# EAGLE schematic untitled (EAGLE 9.4.0)
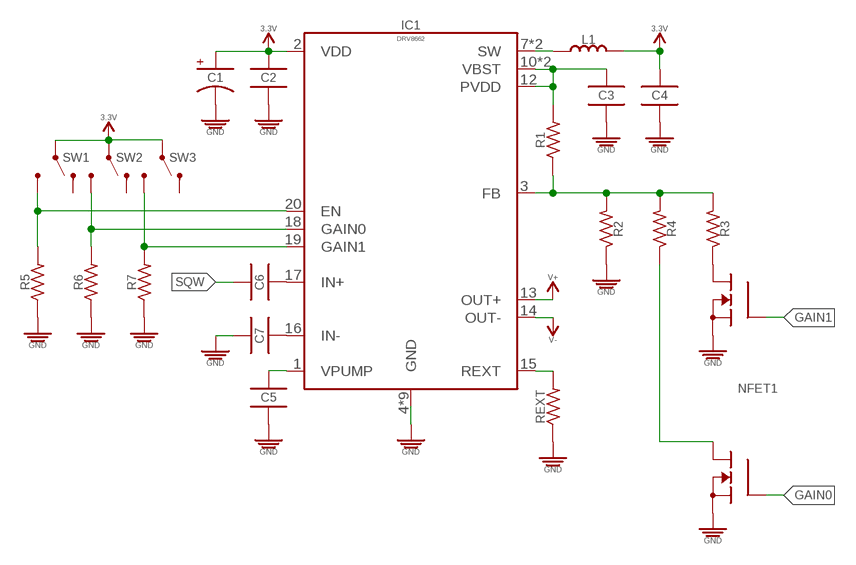
[diagram p0: schematic, sheet 1]

## Parts
C1  100uF/10V  100UF-POLARIZED_TANT_SMD-1206_10V-20%  [CAPCP3216X160]
C2  0.1uF/50V  0.1UF_SMD-0402_50V-10%  [CAPC1005X55_SMD-0402]
C3  0.1uF/250V/0805  0.1UF_SMD-0805_250V-10%  [CAPC2012X95_SMD-0805]
C4  0.1uF/50V  0.1UF_SMD-0603_50V-20%  [CAPC1608X95]
C5  0.1uF/50V  0.1UF_SMD-0402_50V-10%  [CAPC1005X55_SMD-0402]
C6  0.1uF/50V  0.1UF_SMD-0402_50V-10%  [CAPC1005X55_SMD-0402]
C7  0.1uF/50V  0.1UF_SMD-0402_50V-10%  [CAPC1005X55_SMD-0402]
IC1  DRV8662  DRV8662_PIEZO_HAPTICS_DRIVER_QFN-20-EP  [QFN50P400X400X100-21T270]
L1  4.7uH/2A/1008  4.7UH_SMD-1008_2A-0.200OHM-20%  [INDC2520X100]
NFET1  2N7002DW  MOSFET_N-CHANNEL_2-ARRAY_2N7002DW_115MA-60V  [SOT65P230X110-6]
R1  768K  768KΩ_SMD-0402_1/16W-1%  [RESC1005X35_SMD-0402]
R2  115K  35.7KΩ_SMD-0402_1/16W-1%  [RESC1005X35_SMD-0402]
R3  220K  20KΩ_SMD-0402_1/16W-1%  [RESC1005X35_SMD-0402]
R4  100K  41.2KΩ_SMD-0402_1/16W-1%  [RESC1005X35_SMD-0402]
R5  10K  10KΩ_SMD-0402_1/16W-5%  [RESC1005X35_SMD-0402]
R6  10K  10KΩ_SMD-0402_1/16W-5%  [RESC1005X35_SMD-0402]
R7  10K  10KΩ_SMD-0402_1/16W-5%  [RESC1005X35_SMD-0402]
REXT  7.5K  7.5KΩ_SMD-0402_1/16W-1%  [RESC1005X35_SMD-0402]
SW1  300mA/4V  SWITCH_SPDT_RA_SMD_300MA-4V_6.7L-2.6W  [SW_SLIDE_SPDT_RA_SMD_4V_300MA_6.7L-2.6W]
SW2  300mA/4V  SWITCH_SPDT_RA_SMD_300MA-4V_6.7L-2.6W  [SW_SLIDE_SPDT_RA_SMD_4V_300MA_6.7L-2.6W]
SW3  300mA/4V  SWITCH_SPDT_RA_SMD_300MA-4V_6.7L-2.6W  [SW_SLIDE_SPDT_RA_SMD_4V_300MA_6.7L-2.6W]

## Nets
3.3V: C1.A C2.1 C4.1 IC1.2(VDD) L1.2 SW1.2(P) SW2.2(P) SW3.2(P)
EN: IC1.20(EN) R5.2 SW1.3(S2)
FB: IC1.3(FB) R1.1 R2.2 R3.2 R4.2
GAIN0: IC1.18(GAIN0) NFET1.5(G2) R6.2 SW2.3(S2)
GAIN1: IC1.19(GAIN1) NFET1.2(G1) R7.2 SW3.3(S2)
GND [DGND]: C1.K C2.2 C3.2 C4.2 C5.2 C7.1 IC1.4(GND) IC1.5(GND) IC1.6(GND) IC1.9(GND) IC1.EP(GND) IC1.P$1(GND) IC1.P$2(GND) IC1.P$3(GND) IC1.P$4(GND) NFET1.1(S1) NFET1.4(S2) R2.1 R5.1 R6.1 R7.1 REXT.1
N$42: IC1.7(SW) IC1.8(SW) L1.1
N$43: C5.1 IC1.1(VPUMP)
N$44: C3.1 IC1.10(VBST) IC1.11(VBST) IC1.12(PVDD) R1.2
N$48: IC1.15(REXT) REXT.2
N$49: NFET1.6(D1) R3.1
N$51: NFET1.3(D2) R4.1
N$52: C6.2 IC1.17(IN+)
N$56: C7.2 IC1.16(IN-)
SQW: C6.1
V+: IC1.13(OUT+)
V- [DGND]: IC1.14(OUT-)
Unconnected: SW1.1(S1) SW2.1(S1) SW3.1(S1)

## Library data of the parts
C1 = _capacitors:100UF-POLARIZED; DATASHEET: http://datasheets.avx.com/TLJ.pdf; DIST: Digikey; DISTLINK: https://www.digikey.com/products/en?keywords=478-5651-1-ND; DISTPN: 478-5651-1-ND; MFR: AVX Corporation; MPN: TLJA107M010R1400
C2 C5-C7 = _capacitors:0.1UF; DATASHEET: https://product.tdk.com/info/en/catalog/datasheets/mlcc_commercial_soft_en.pdf; DIST: Digikey; DISTLINK: https://www.digikey.com/products/en?keywords=445-173610-1-ND; DISTPN: 445-173610-1-ND; MFR: TDK Corporation; MPN: C1005X7R1H104K050BE
C3 = _capacitors:0.1UF; DATASHEET: https://product.tdk.com/info/en/catalog/datasheets/mlcc_commercial_soft_en.pdf; DIST: Digikey; DISTLINK: https://www.digikey.com/products/en?keywords=445-6808-1-ND; DISTPN: 445-6808-1-ND; MFR: TDK Corporation; MPN: C2012X7T2E104M125AE
C4 = _capacitors:0.1UF; DATASHEET: https://product.tdk.com/info/en/documents/chara_sheet/CGA3E3X8R1H104K080AB.pdf; DIST: Digikey; DISTLINK: https://www.digikey.com/products/en?keywords=445-12606-1-ND; DISTPN: 445-12606-1-ND; MFR: TDK Corporation; MPN: CGA3E3X8R1H104K080AB
IC1 = _special:DRV8662_PIEZO_HAPTICS_DRIVER; DATASHEET: http://www.ti.com/lit/ds/symlink/drv8662.pdf; DIST: Digikey; DISTLINK: https://www.digikey.com/products/en?keywords=296-29164-1-ND; DISTPN: 296-29164-1-ND; MFR: Texas Instruments; MPN: DRV8662RGPR
L1 = _inductors:4.7UH; DATASHEET: https://www.murata.com/~/media/webrenewal/products/inductor/chip/tokoproducts/wirewoundmetalalloychiptype/m_dfe252012p.ashx; DIST: Digkey; DISTLINK: https://www.digikey.com/products/en?keywords=490-10651-1-ND; DISTPN: 490-10651-1-ND; MFR: Murata Electronics North America; MPN: DFE252012P-4R7M=P2
NFET1 = _transistors:MOSFET_N-CHANNEL_2-ARRAY; DATASHEET: http://www.mccsemi.com/up_pdf/2N7002DW(SOT-363).PDF; DIST: Digikey; DISTLINK: https://www.digikey.com/products/en?keywords=2N7002DW-TPCT-ND; DISTPN: 2N7002DW-TPCT-ND; MFR: Micro Commercial Co; MPN: 2N7002DW-TP
R1 = _resistors:768KΩ; DATASHEET: http://www.yageo.com/documents/recent/PYu-RC_Group_51_RoHS_L_9.pdf; DIST: Digikey; DISTLINK: https://www.digikey.com/products/en?keywords=311-768KLRCT-ND; DISTPN: 311-768KLRCT-ND; MFR: Yageo; MPN: RC0402FR-07768KL
R2 = _resistors:35.7KΩ; DATASHEET: http://www.yageo.com/documents/recent/PYu-RC_Group_51_RoHS_L_9.pdf; DIST: Digikey; DISTLINK: https://www.digikey.com/products/en?keywords=311-35.7KLRCT-ND; DISTPN: 311-35.7KLRCT-ND; MFR: Yageo; MPN: RC0402FR-0735K7L; VALUE: 35.7K
R3 = _resistors:20KΩ; DATASHEET: http://www.yageo.com/documents/recent/PYu-RC_Group_51_RoHS_L_9.pdf; DIST: Digikey; DISTLINK: https://www.digikey.com/products/en?keywords=311-20.0KLRCT-ND; DISTPN: 311-20.0KLRCT-ND; MFR: Yageo; MPN: RC0402FR-0720KL; VALUE: 20K
R4 = _resistors:41.2KΩ; DATASHEET: http://www.yageo.com/documents/recent/PYu-RC_Group_51_RoHS_L_9.pdf; DIST: Digikey; DISTLINK: https://www.digikey.com/products/en?keywords=YAG3155CT-ND; DISTPN: YAG3155CT-ND; MFR: Yageo; MPN: RC0402FR-0741K2L; VALUE: 41.2K
R5-R7 = _resistors:10KΩ; DATASHEET: http://www.yageo.com/NewPortal/yageodocoutput?fileName=/pdf/R-Chip/PYu-RC_51_RoHS_P_0.pdf; DIST: Digikey; DISTLINK: https://www.digikey.com/products/en?keywords=YAG1281CT-ND; DISTPN: YAG1281CT-ND; MFR: Yageo; MPN: RC0402JR-0710KP
REXT = _resistors:7.5KΩ; DATASHEET: http://www.yageo.com/documents/recent/PYu-RC_Group_51_RoHS_L_9.pdf; DIST: Digikey; DISTLINK: https://www.digikey.com/products/en?keywords=311-7.50KLRCT-ND; DISTPN: 311-7.50KLRCT-ND; MFR: Yageo; MPN: RC0402FR-077K5L
SW1-SW3 = _switches:SWITCH_SPDT; CREATOR: MrSwirlyEyes; DATASHEET: https://media.digikey.com/pdf/Data%20Sheets/APEM%20Components%20PDFs/MA_Series_.pdf; DIST: Digikey; DISTLINK: https://www.digikey.com/products/en?keywords=679-1847-1-ND; DISTPN: 679-1847-1-ND; MFR: APEM Inc.; MPN: MA12RTR; TESTED: YES

## Net classes
4 DGND: width 0.152 mm